# EasyEDA schematic EasyEDA_v2.b.json
TITLE: CCM Add-on Module - USB-C, Power, Boot, Reset; REV: v2.b; Date: 2023.05; Sheet: 1/1; Drawn By: bryan costanich; Company: Wilderness Labs
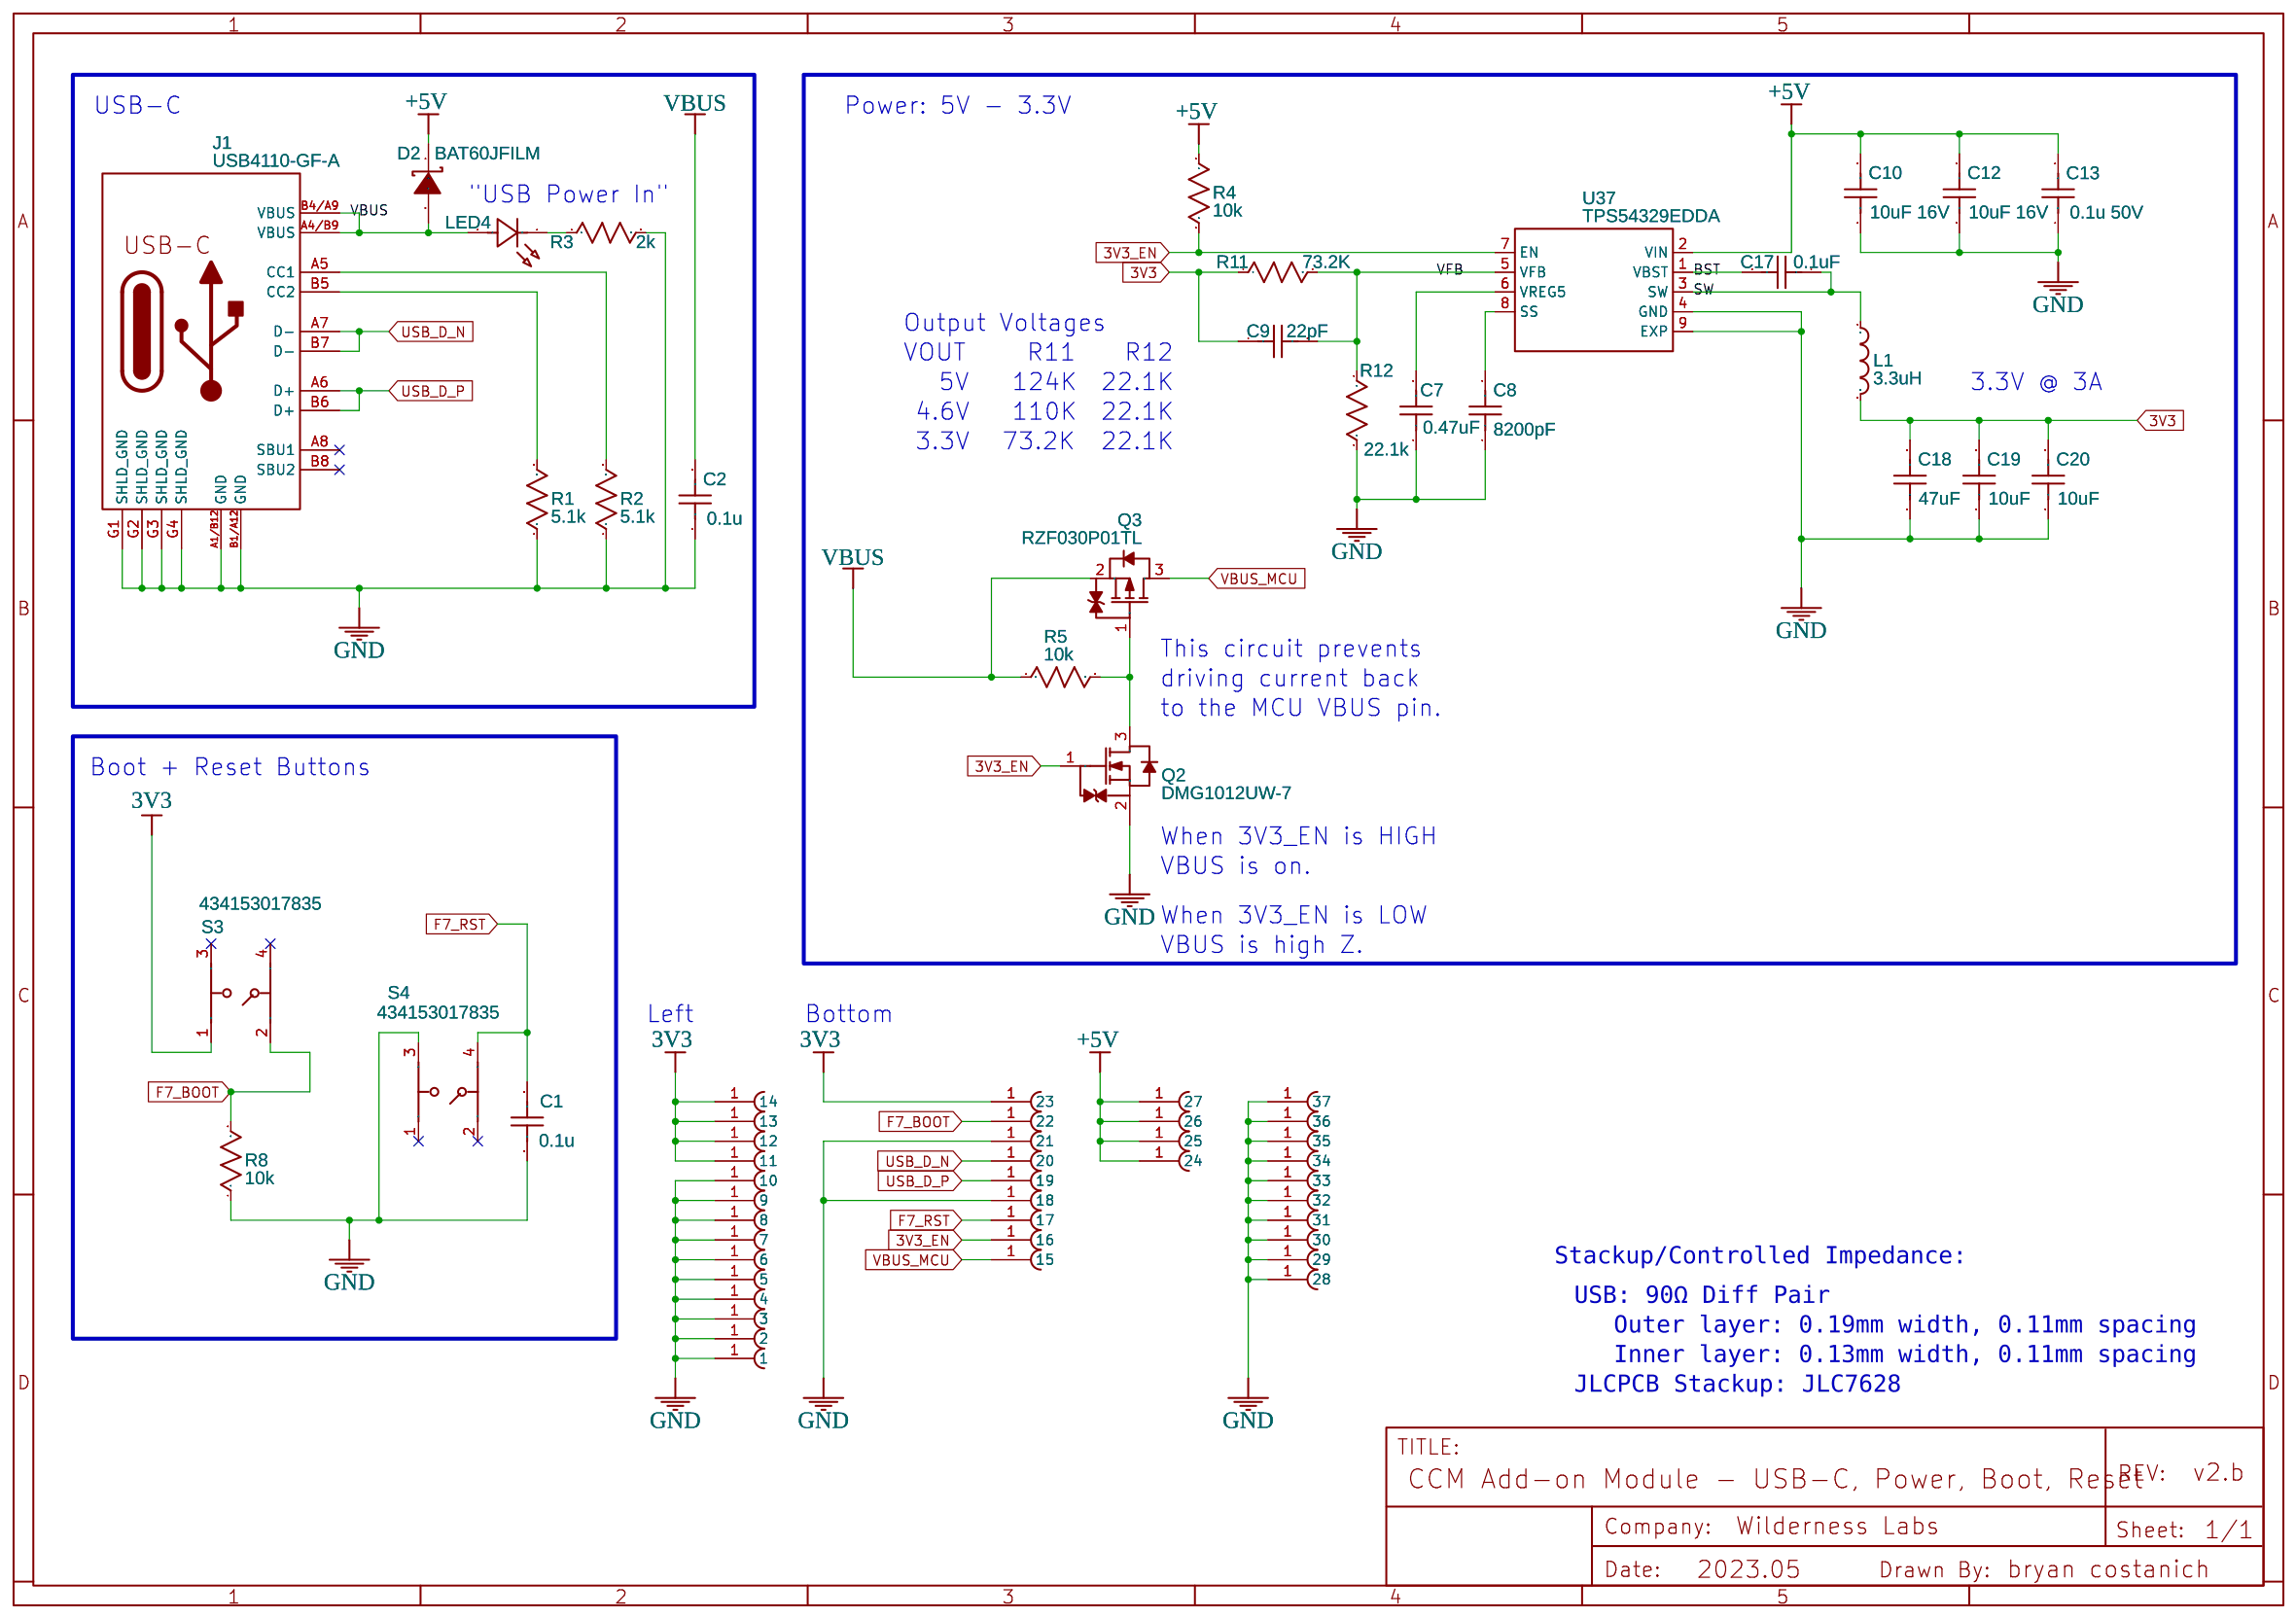
[diagram p0: schematic sheet]

## Parts
C1  0.1u  [C0603]
C2  0.1u  [C0603]
C7  0.47uF  [C0603]
C8  8200pF  [C0603]
C9  22pF  [C0603]
C10  10uF 16V  [C0805]
C12  10uF 16V  [C0805]
C13  0.1u 50V  [C0603]
C17  0.1uF  [C0603]
C18  47uF  [C1210]
C19  10uF  [C0805]
C20  10uF  [C0805]
D2  BAT60JFILM  [SOD-323_L1.8-W1.3-LS2.5-RD]
J1  USB4110-GF-A  [GCT_USB4110-GF-A]
L1  3.3uH  [IND-SMD_L4.9-W4.9_NRS50XX]
LED4  EAST16083BA0  [LED0603-RD]
Q2  DMG1012UW-7  [SOT-323-3_L2.2-W1.3-P1.30-LS2.1-BR]
Q3  RZF030P01TL  [SOT-323-3_L2.0-W1.7-P0.65-LS2.1-BL]
R1  5.1k  [R0603]
R2  5.1k  [R0603]
R3  2k  [R0603]
R4  10k  [R0603]
R5  10k  [R0603]
R8  10k  [R0603]
R11  73.2K  [R0603]
R12  22.1k  [R0603]
S3  434153017835  [434153017835]
S4  434153017835  [434153017835]
U1  1.2MM SMT Castellation  [1.2MM SMT CASTELLATION]
U2  1.2MM SMT Castellation  [1.2MM SMT CASTELLATION]
U3  1.2MM SMT Castellation  [1.2MM SMT CASTELLATION]
U5  1.2MM SMT Castellation  [1.2MM SMT CASTELLATION]
U6  1.2MM SMT Castellation  [1.2MM SMT CASTELLATION]
U7  1.2MM SMT Castellation  [1.2MM SMT CASTELLATION]
U8  1.2MM SMT Castellation  [1.2MM SMT CASTELLATION]
U9  1.2MM SMT Castellation  [1.2MM SMT CASTELLATION]
U10  1.2MM SMT Castellation  [1.2MM SMT CASTELLATION]
U11  1.2MM SMT Castellation  [1.2MM SMT CASTELLATION]
U12  1.2MM SMT Castellation  [1.2MM SMT CASTELLATION]
U13  1.2MM SMT Castellation  [1.2MM SMT CASTELLATION]
U14  1.2MM SMT Castellation  [1.2MM SMT CASTELLATION]
U15  1.2MM SMT Castellation  [1.2MM SMT CASTELLATION]
U16  1.2MM SMT Castellation  [1.2MM SMT CASTELLATION]
U17  1.2MM SMT Castellation  [1.2MM SMT CASTELLATION]
U18  1.2MM SMT Castellation  [1.2MM SMT CASTELLATION]
U19  1.2MM SMT Castellation  [1.2MM SMT CASTELLATION]
U20  1.2MM SMT Castellation  [1.2MM SMT CASTELLATION]
U21  1.2MM SMT Castellation  [1.2MM SMT CASTELLATION]
U22  1.2MM SMT Castellation  [1.2MM SMT CASTELLATION]
U23  1.2MM SMT Castellation  [1.2MM SMT CASTELLATION]
U24  1.2MM SMT Castellation  [1.2MM SMT CASTELLATION]
U25  1.2MM SMT Castellation  [1.2MM SMT CASTELLATION]
U26  1.2MM SMT Castellation  [1.2MM SMT CASTELLATION]
U27  1.2MM SMT Castellation  [1.2MM SMT CASTELLATION]
U28  1.2MM SMT Castellation  [1.2MM SMT CASTELLATION]
U29  1.2MM SMT Castellation  [1.2MM SMT CASTELLATION]
U30  1.2MM SMT Castellation  [1.2MM SMT CASTELLATION]
U31  1.2MM SMT Castellation  [1.2MM SMT CASTELLATION]
U32  1.2MM SMT Castellation  [1.2MM SMT CASTELLATION]
U33  1.2MM SMT Castellation  [1.2MM SMT CASTELLATION]
U34  1.2MM SMT Castellation  [1.2MM SMT CASTELLATION]
U35  1.2MM SMT Castellation  [1.2MM SMT CASTELLATION]
U36  1.2MM SMT Castellation  [1.2MM SMT CASTELLATION]
U37  TPS54329EDDA  [SOIC-8_L5.0-W4.0-P1.27-LS6.0-BL-EP2.0]
U39  1.2MM SMT Castellation  [1.2MM SMT CASTELLATION]
U53  1.2MM SMT Castellation  [1.2MM SMT CASTELLATION]

## Library data of the parts
C1 = C_0603_US: Contributor: LCEDA_Lib; Manufacturer Part: CC0603KRX7R7BB104; Manufacturer: Yageo
C2 C13 C17 = C_0402_US: Contributor: LCEDA_Lib; Manufacturer Part: CC0603KRX7R9BB103; Manufacturer: Yageo
C7 = C_0402_US: Contributor: LCEDA_Lib; Manufacturer Part: CC0603KRX7R8BB474; Manufacturer: Yageo
C8 = C_0603_US: Contributor: LCEDA_Lib; Manufacturer Part: CC0603KRX7R9BB822; Manufacturer: Yageo
C9 = C_0603_US: Contributor: LCEDA_Lib; Manufacturer Part: CC0603JRNPO9BN220; Manufacturer: Yageo
C10 C12 C19 C20 = C_0805_US: Contributor: LCEDA_Lib; Manufacturer Part: CC0805KRX5R7BB106; Manufacturer: Yageo
C18 = C_0402_US: Contributor: LCEDA_Lib; Manufacturer Part: GRM32ER71A476ME15L; Manufacturer: Murata
D2 = BAT60JFILM: Supplier: LCSC; Manufacturer: STMicroelectronics; Contributor: LCSC; Supplier Part: C133103; JLCPCB Part Class: Extended Part
J1 = USB4110-GF-A: Manufacturer: Global Connector Technology; Manufacturer Part: USB4105-GF-A; Contributor: bryan_6020; link: https://gct.co/connector/usb4105
L1 = NRS5040T3R3NMGJ: Supplier: LCSC; Supplier Part: C222946; Manufacturer: Taiyo Yuden; Contributor: LCSC; JLCPCB Part Class: Extended Part
LED4 = EAST16083BA0: Manufacturer: Everlight; Contributor: LCSC
Q2 = DMG1012UW-7: Supplier: LCSC; Supplier Part: C156390; Manufacturer: Diodes Incorporated; Contributor: LCSC; JLCPCB Part Class: Extended Part
Q3 = RZF030P01TL: Supplier: LCSC; Supplier Part: C2941618; Manufacturer: ROHM(罗姆); link: https://atta.szlcsc.com//upload/public/pdf/source/20220111/150AD92360A789591394EA5BC6065DE4.pdf; Contributor: LCSC
R1 R2 = R_0603_US: Contributor: LCEDA_Lib; Manufacturer Part: RC0603FR-075K1L; Manufacturer: Yageo
R3 = R_0603_US: Contributor: LCEDA_Lib; Manufacturer Part: RC0603FR-072KL; Manufacturer: Yageo
R4 R5 R8 = R_0603_US: Contributor: LCEDA_Lib; Manufacturer Part: RC0603FR-0710KL; Manufacturer: Yageo
R11 = R_0603_US: Contributor: LCEDA_Lib; Manufacturer Part: RC0603FR-0773K2L; Manufacturer: Yageo
R12 = R_0603_US: Contributor: LCEDA_Lib; Manufacturer Part: RC0603FR-0722K1L; Manufacturer: Yageo
S3 S4 = 434153017835: WS-TASV; Manufacturer: Wurth Elektronik
U1-U3 U5-U36 U39 U53 = 1.2MM SMT Castellation: Contributor: bryan_6020
U37 = TPS54329EDDAR LOGICAL: Supplier: LCSC; Manufacturer: TI; Contributor: LCSC; Supplier Part: C38344; JLCPCB Part Class: Extended Part

## Nets
3V3: C9.1 C18.2 C19.2 C20.2 L1.2 R11.1 S3.1 U13.1(14) U14.1(13) U15.1(12) U16.1(11) U23.1(23)
3V3_EN: Q2.1(G) R4.2 U22.1(16) U37.7(EN)
+5V: C10.2 C12.2 C13.2 D2.1(K) R4.1 U2.1(25) U24.1(26) U26.1(27) U29.1(24) U37.2(VIN)
GND: C1.1 C2.1 C7.1 C8.1 C10.1 C12.1 C13.1 C18.1 C19.1 C20.1 J1.A1/B12(GND) J1.B1/A12(GND) J1.G1(SHLD_GND) J1.G2(SHLD_GND) J1.G3(SHLD_GND) J1.G4(SHLD_GND) Q2.2(S) R1.1 R2.1 R3.2 R8.1 R12.1 S4.3 U1.1(2) U3.1(3) U5.1(4) U6.1(5) U7.1(10) U8.1(9) U9.1(8) U10.1(7) U11.1(6) U19.1(18) U20.1(28) U25.1(31) U28.1(21) U30.1(30) U31.1(29) U32.1(32) U33.1(35) U34.1(34) U35.1(33) U36.1(36) U37.4(GND) U37.9(EXP) U39.1(37) U53.1
VBUS: C2.2 D2.2(A) J1.A4/B9(VBUS) J1.B4/A9(VBUS) LED4.2(A) Q3.2(S) R5.1
VBUS_MCU: Q3.3(D) U12.1(15)
BST: C17.2 U37.1(VBST)
F7_BOOT: R8.2 S3.2 U27.1(22)
F7_RST: C1.2 S4.4 U21.1(17)
SW: C17.1 L1.1 U37.3(SW)
USB_D_N: J1.A7(D-) J1.B7(D-) U17.1(20)
USB_D_P: J1.A6(D+) J1.B6(D+) U18.1(19)
VFB: C9.2 R11.2 R12.2 U37.5(VFB)
Net-(C7-2): C7.2 U37.6(VREG5)
Net-(C8-2): C8.2 U37.8(SS)
Net-(J1-A5): J1.A5(CC1) R2.2
Net-(J1-B5): J1.B5(CC2) R1.2
Net-(LED4-1): LED4.1(K) R3.1
Net-(Q2-3): Q2.3(D) Q3.1(G) R5.2

Not connected (* = marked no-connect by the designer): J1 A8(SBU1)* B8(SBU2)*; S3 3* 4*; S4 1* 2*

## Notes on the sheet
- USB-C
- Power: 5V - 3.3V
- "USB Power In"
- Output Voltages
- VOUT
- R11
- R12
- 5V
- 124K
- 22.1K
- 3.3V @ 3A
- 4.6V
- 110K
- 22.1K
- 3.3V
- 73.2K
- 22.1K
- This circuit prevents
- driving current back
- to the MCU VBUS pin.
- Boot + Reset Buttons
- When 3V3_EN is HIGH
- VBUS is on.
- When 3V3_EN is LOW
- VBUS is high Z.
- Left
- Bottom
- Stackup/Controlled Impedance:
- USB: 90Ω Diff Pair
- Outer layer: 0.19mm width, 0.11mm spacing
- Inner layer: 0.13mm width, 0.11mm spacing
- JLCPCB Stackup: JLC7628
